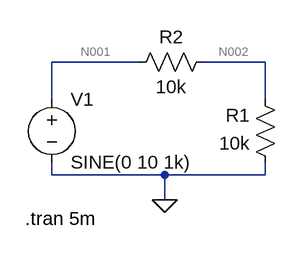
[diagram p0: schematic Draft2.asc]
Draft2.asc, the LTspice schematic file:
Version 4
SHEET 1 880 680
WIRE 192 96 80 96
WIRE 352 96 272 96
WIRE 80 144 80 96
WIRE 352 144 352 96
WIRE 80 240 80 224
WIRE 224 240 80 240
WIRE 352 240 352 224
WIRE 352 240 224 240
WIRE 224 272 224 240
FLAG 224 272 0
SYMBOL voltage 80 128 R0
WINDOW 123 0 0 Left 2
WINDOW 39 0 0 Left 2
SYMATTR InstName V1
SYMATTR Value SINE(0 10 1k)
SYMATTR Value2 ""
SYMATTR SpiceLine ""
SYMBOL res 288 80 R90
WINDOW 0 0 56 VBottom 2
WINDOW 3 32 56 VTop 2
SYMATTR InstName R2
SYMATTR Value 10k
SYMBOL res 368 240 R180
WINDOW 0 36 76 Left 2
WINDOW 3 36 40 Left 2
SYMATTR InstName R1
SYMATTR Value 10k
TEXT 46 296 Left 2 !.tran 5m

The netlist it stands for:
* Draft2.asc
V1 N001 0 SINE(0 10 1k)
R2 N002 N001 10k
R1 0 N002 10k
.tran 5m
.backanno
.end

* Results of the author's LTspice run, read from the files saved beside the schematic
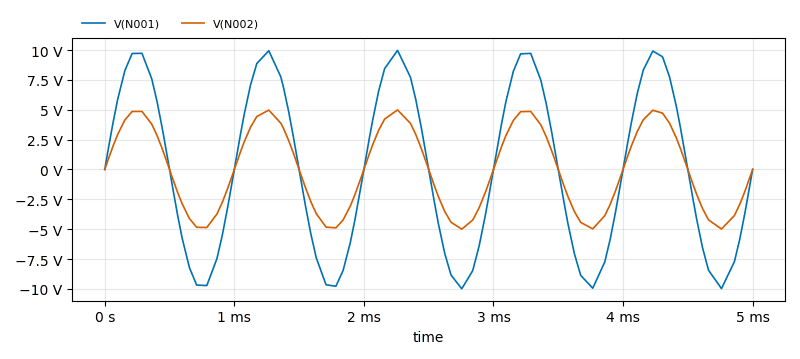
[diagram p1: Transient Analysis of Draft2.asc, plotted from the saved traces]
* Transient Analysis, 1 run:
*   V(N001): min -9.987 V, max 9.969 V, average 2.07 mV, rms 6.981 V, last 0 V
*   V(N002): min -4.994 V, max 4.985 V, average 1.035 mV, rms 3.491 V, last 0 V